# EAGLE schematic microphone (EAGLE 6.6.0)
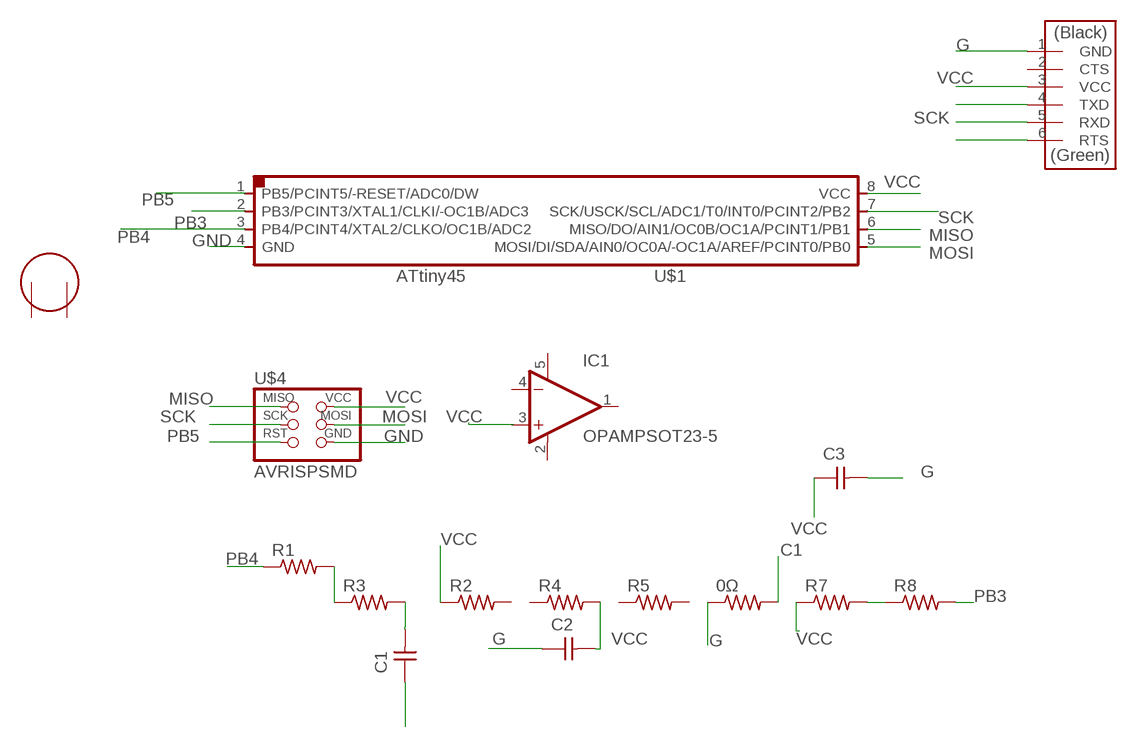
[diagram p0: schematic, sheet 1]

## Parts
0Ω  RES-US1206FAB  [R1206FAB]
C1  CAP-UNPOLARIZEDFAB  [C1206FAB]
C2  CAP-UNPOLARIZEDFAB  [C1206FAB]
C3  CAP-UNPOLARIZEDFAB  [C1206FAB]
IC1  OPAMPSOT23-5  [SOT23-5]
R1  RES-US1206FAB  [R1206FAB]
R2  RES-US1206FAB  [R1206FAB]
R3  RES-US1206FAB  [R1206FAB]
R4  RES-US1206FAB  [R1206FAB]
R5  RES-US1206FAB  [R1206FAB]
R7  RES-US1206FAB  [R1206FAB]
R8  RES-US1206FAB  [R1206FAB]
U$1  ATTINY45SI  [SOIC8]
U$2  FTDI-SMD-HEADER  [1X06SMD]
U$4  AVRISPSMD  [2X03SMD]
U$5  ELECTRET  [ELECTRET_2742PBJ-A]

## Nets
C1: 0Ω.2
G: 0Ω.1 C2.1 C3.2 U$2.1(GND)
GND: U$1.4(GND) U$4.6(GND)
MISO: U$1.6(MISO/DO/AIN1/OC0B/OC1A/PCINT1/PB1) U$4.1(MISO)
MOSI: U$1.5(MOSI/DI/SDA/AIN0/OC0A/-OC1A/AREF/PCINT0/PB0) U$4.4(MOSI)
N$1: R7.2 R8.1
N$2: R1.2 R3.1
N$4: U$2.6(RTS)
N$5: U$2.4(TXD)
N$6: C1.2 R3.2
N$7: C1.1
PB3: R8.2 U$1.2(PB3/PCINT3/XTAL1/CLKI/-OC1B/ADC3)
PB4: R1.1 U$1.3(PB4/PCINT4/XTAL2/CLKO/OC1B/ADC2)
PB5: U$1.1(PB5/PCINT5/-RESET/ADC0/DW) U$4.5(RST)
SCK: U$1.7(SCK/USCK/SCL/ADC1/T0/INT0/PCINT2/PB2) U$2.5(RXD) U$4.3(SCK)
VCC: C2.2 C3.1 R2.1 R4.2 R7.1 U$1.8(VCC) U$2.3(VCC) U$4.2(VCC)
Unconnected: IC1.1(OUT) IC1.3(+IN) IC1.4(-IN) R2.2 R4.1 R5.1 R5.2 U$2.2(CTS) U$5.P$1 U$5.P$2

## Power pins joined to a net without a drawn wire
V+: IC1.5(V+)
V-: IC1.2(V-)

## Library data of the parts
0Ω R1-R5 R7 R8 = fab:RES-US: Resistor (US Symbol) Variants with postfix FAB are widened to allow the routing of internal traces
C1-C3 = fab:CAP-UNPOLARIZED
IC1 = fab:OPAMP: Rail-to-Rail Operational Amplifiers Single-Supply, MicroAmplifier(TM) Series
U$1 = fab:ATTINY45
U$2 = fab:FTDI-SMD-HEADER
U$4 = fab:AVRISP
U$5 = fab:ELECTRET